# EAGLE design CS-O-2LED-RB_RevD2 (EAGLE 7.2.0)
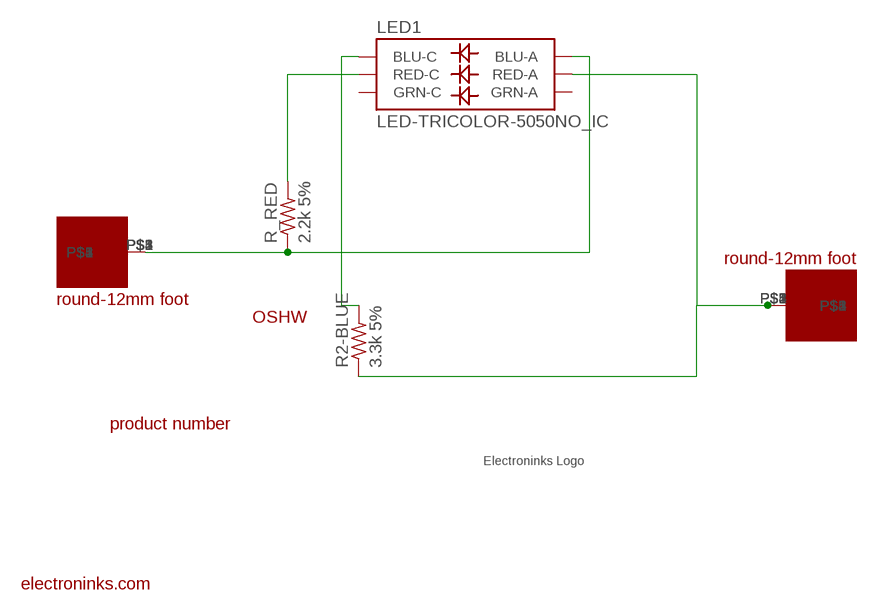
[diagram p0: schematic, sheet 1]

## Parts
LED1  LED-TRICOLOR-5050NO_IC  [LED-TRICOLOR-5050]
R2-BLUE  3.3k 5%  R-US_R0603  [R0603]
R_RED  2.2k 5%  R-US_R0603  [R0603]
U$1  ROUND-12MM-FOOT-1.8MM  [ROUND-12MM-FOOT]
U$2  ROUND-12MM-FOOT-1.8MM  [ROUND-12MM-FOOT]
U$4  ELECTRONINKS_LOGO_15MM  [ELECTRONINKS_LOGO_15MM]
U$5  ELECTRONINKS_COM_15MM  [ELECTRONINKS_COM_15MM]
U$7  OSHW_4MM  [OHSW_4MM]
U$8  CS_O_2LED_RB  [CS_O_2LED_RB]

## Nets
N$1: LED1.1(RED-A) R2-BLUE.1 U$1.P$1 U$1.P$2 U$1.P$3 U$1.P$4 U$1.P$5
N$2: LED1.6(RED-C) R_RED.2
N$3: LED1.3(BLU-A) R_RED.1 U$2.P$1
N$4: LED1.4(BLU-C) R2-BLUE.2
Unconnected: LED1.2(GRN-A) LED1.5(GRN-C) U$2.P$2 U$2.P$3 U$2.P$4 U$2.P$5

## Library data of the parts
LED1 = SparkFun-LED:LED-TRICOLOR-5050
R2-BLUE R_RED = rcl:R-US_: RESISTOR, American symbol
U$1 U$2 = electroninks:ROUND-12MM-FOOT-1.8MM
U$4 = electroninks:ELECTRONINKS_LOGO_15MM
U$5 = electroninks:ELECTRONINKS_COM_15MM
U$7 = electroninks:OSHW_4MM
U$8 = electroninks:CS_O_2LED_RB

## Board
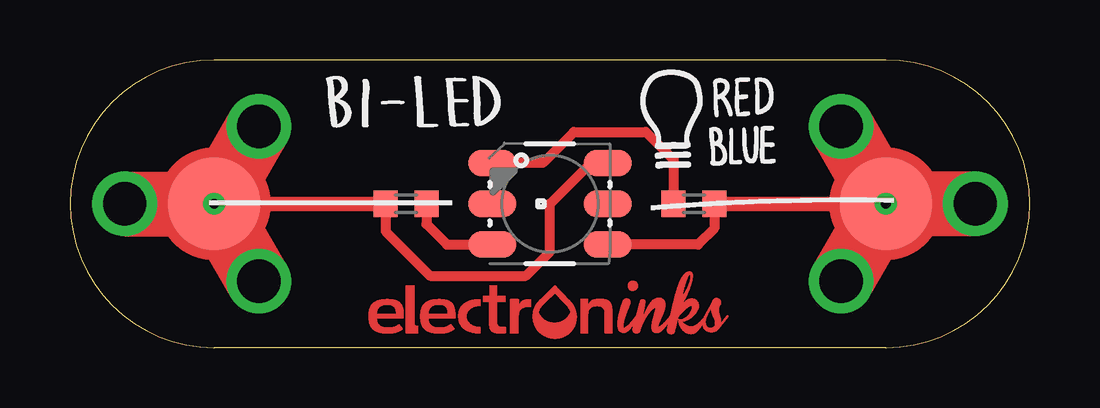
[diagram p1: board, top side]
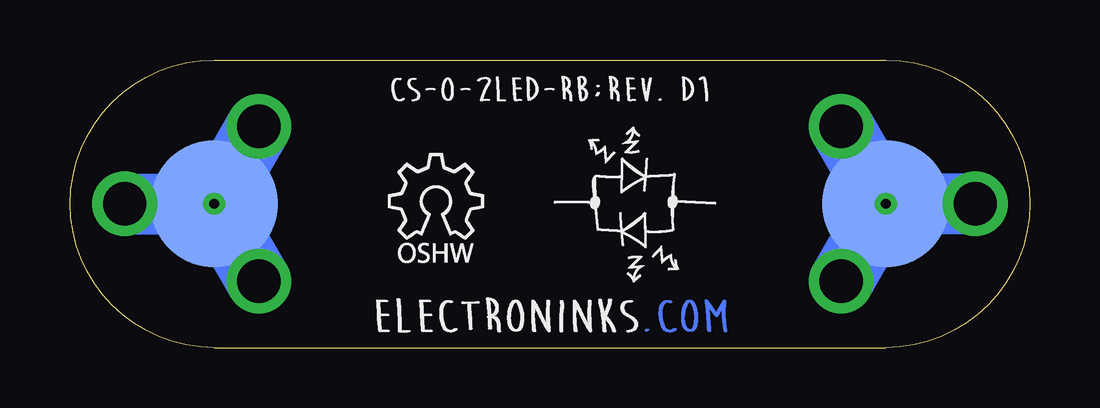
[diagram p2: board, bottom side, seen from below]

Size 40 x 12 mm. Coordinates in mm from the lower left corner, seen from the top.
Outline: 34,0 arc180 34,12 6,12 arc180 6,0 34,0
Copper layers (1*16): Top 0.035mm / dielectric 1.5mm / Bottom 0.035mm
Design rules "default": minimum track width 10mil, minimum drill 24mil, track to track 8mil, track to pad 8mil, pad to pad 8mil, via to via 8mil, smd to smd 8mil, copper to edge 40mil, drill to drill 8mil, minimum pad ring 10mil, minimum via ring 8mil, stop-mask expansion 4mil, vias tented up to drill 0mil, thermal gap 10mil

### Footprints (pad centres in the part's own frame; a part is rotated, then mirrored left to right if it is on the bottom)
LED-TRICOLOR-5050 = smd 2 x 1.1: 1 -2.4,1.7; 2 -2.4,0; 3 -2.4,-1.7; 4 2.4,-1.7; 5 2.4,0; 6 2.4,1.7
R0603 = smd 1 x 1.1: 1 -0.85,0; 2 0.85,0
ROUND-12MM-FOOT = drill 1.8: P$1 -3.726,0; P$2 1.863,3.227; P$3 1.863,-3.227 | smd 3.85 x 3.85: P$4 0,0 | smd 5.3 x 5.3 bottom: P$5 0,0 | drill 0.4: P$6 0,0

### Placement (x,y rotation side)
LED1  20,6 180 top
R2-BLUE  26,6 180 top
R_RED  14,6 0 top
U$1  34,6 180 top
U$2  6,6 0 top
U$4  12.44,0.37 0 top
U$5  27.5,0.25 0 bottom
U$7  26.75,3.25 0 bottom
U$8  26.75,10 0 bottom

### Tracks (layer width: path | path; a pad name or v marks a point on that pad's centre or on a via)
N$1
  Top 0.406: R2-BLUE.1 26.85,4.97 26.18,4.3 LED1.1
  Top 0.61: R2-BLUE.1 U$1.P$5
N$2
  Top 0.406: R_RED.2 14.85,5.15 15.7,4.3 LED1.6
N$3
  Top 0.406: R_RED.1 13.15,4.85 15,3 19,3 20,4 20,6 21.7,7.7 LED1.3
  Top 0.61: R_RED.1 6,6
N$4
  Top 0.406: LED1.4 19.7,7.7 21,9 24,9 25.15,7.85 R2-BLUE.2

### Text on the board
tDocu: YELLOW FOOT | BLUE | YELLOW FOOT | RED | 2.2k 5% 0603 | BLUE & RED LED | 3.3k 5% 0603